# Altium schematic sheet S7CAS-PLEIADES-CARTE-MERE_P20_Engine-Control.SchDoc
size Tabloid; Sheet_Name: Engine Control; Size: 11x17
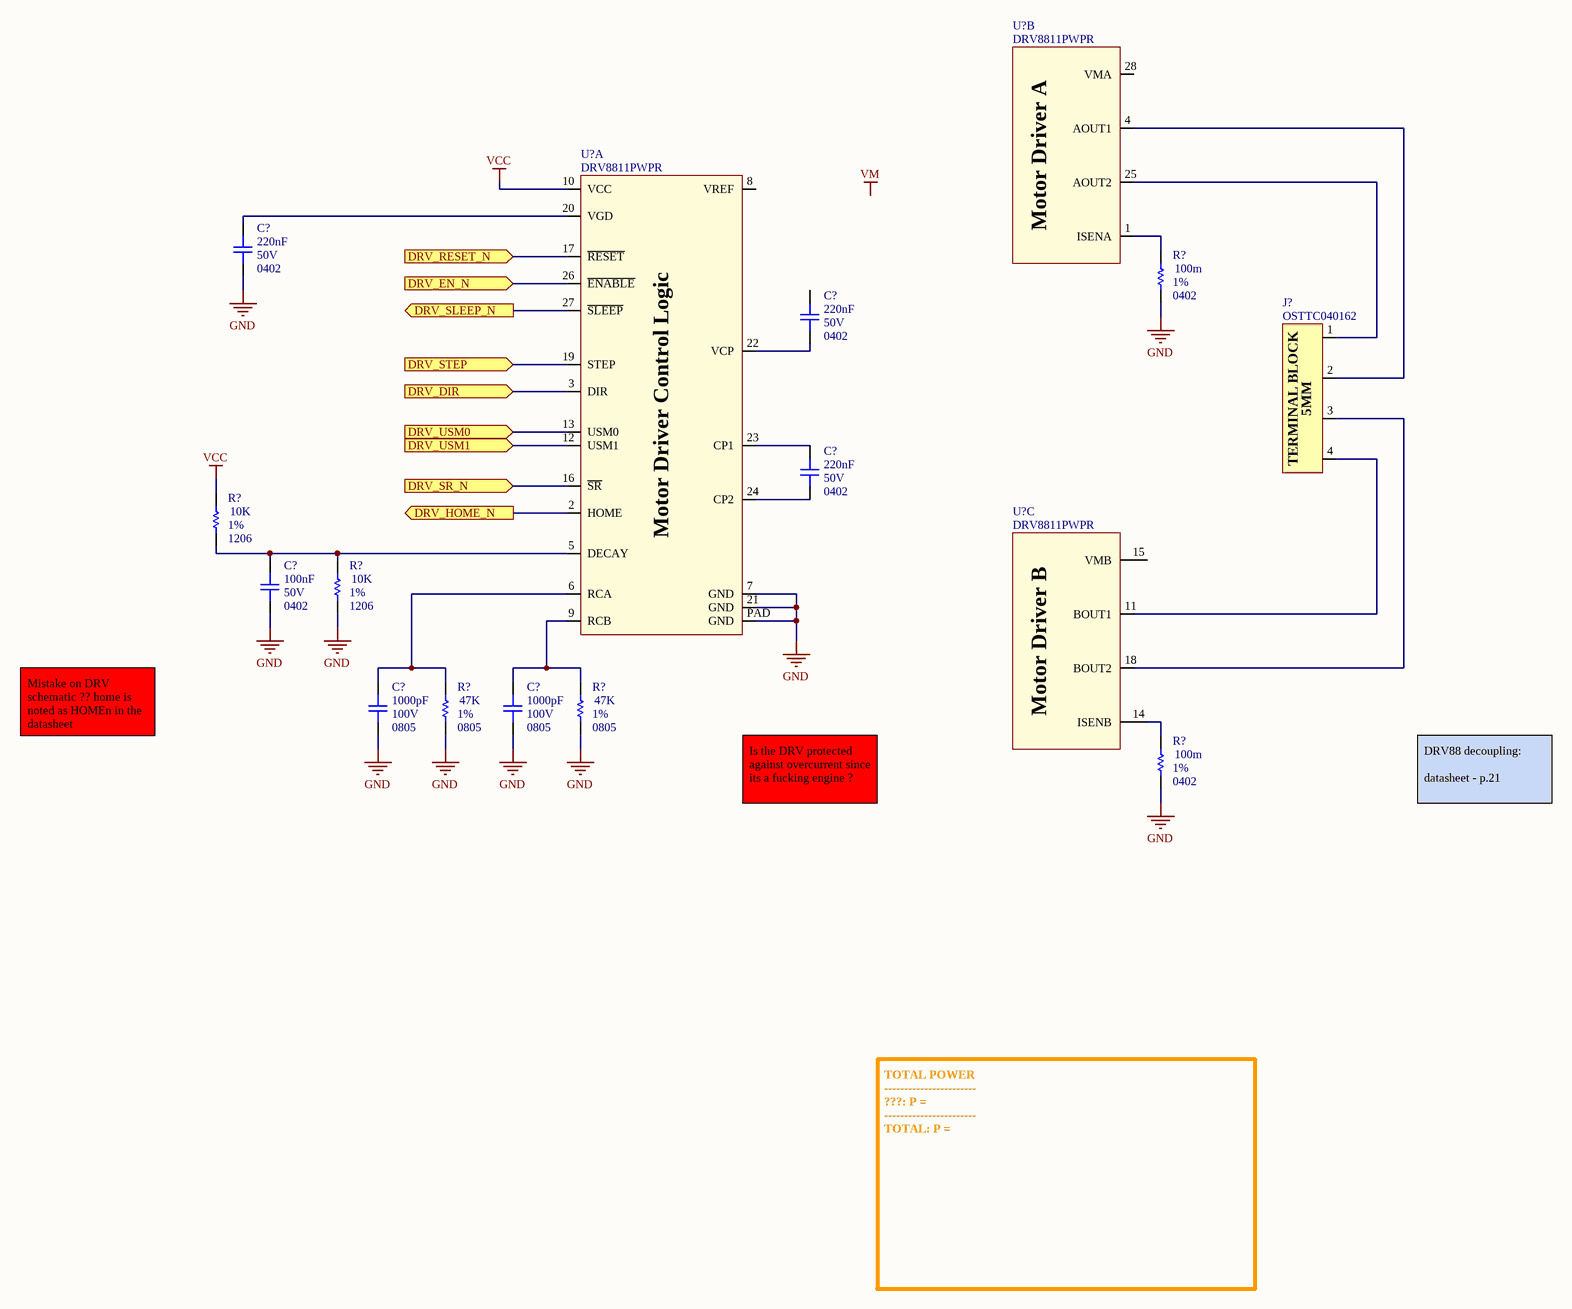
[diagram p0: S7CAS-PLEIADES-CARTE-MERE_P20_Engine-Control.SchDoc]

## Parts
(Parts that share a designator on the sheet are numbered #1, #2 ... from top to bottom, then left to right.)
C?#1  value 220nF  Voltage: 50V  Package: 0402  [CAP_0201]  (hidden comment: CAP - 0201)
C?#2  value 220nF  Voltage: 50V  Package: 0402  [CAP_0201]  (hidden comment: CAP - 0201)
C?#3  value 220nF  Voltage: 50V  Package: 0402  [CAP_0201]  (hidden comment: CAP - 0201)
C?#4  value 100nF  Voltage: 50V  Package: 0402  [CAP_0201]  (hidden comment: CAP - 0201)
C?#5  value 1000pF  Voltage: 100V  Package: 0805  [CAP_0201]  (hidden comment: CAP - 0201)
C?#6  value 1000pF  Voltage: 100V  Package: 0805  [CAP_0201]  (hidden comment: CAP - 0201)
J?  OSTTC040162  [CONN_TERMINAL_OSTTA040161]
R?#1  value 100m  Package: 0402  Precision: 1%  [RES_0402]  (hidden comment: RES - 0402)
R?#2  value 10K  Package: 1206  Precision: 1%  [RES_0402]  (hidden comment: RES - 0402)
R?#3  value 10K  Package: 1206  Precision: 1%  [RES_0402]  (hidden comment: RES - 0402)
R?#4  value 47K  Package: 0805  Precision: 1%  [RES_0402]  (hidden comment: RES - 0402)
R?#5  value 47K  Package: 0805  Precision: 1%  [RES_0402]  (hidden comment: RES - 0402)
R?#6  value 100m  Package: 0402  Precision: 1%  [RES_0402]  (hidden comment: RES - 0402)
U?#1  DRV8811PWPR  [POW_MOTOR_DRV8811PWPR]  (part B of 3)
U?#2  DRV8811PWPR  [POW_MOTOR_DRV8811PWPR]  (part A of 3)
U?#3  DRV8811PWPR  [POW_MOTOR_DRV8811PWPR]  (part C of 3)

## Ports
DRV_DIR (in), DRV_EN_N (in), DRV_HOME_N (out), DRV_RESET_N (in), DRV_SLEEP_N (out), DRV_SR_N (in), DRV_STEP (in), DRV_USM0 (in), DRV_USM1 (in)

## Nets
GND: C?#1.1 C?#4.1 C?#5.1 C?#6.1 R?#1.1 R?#3.1 R?#4.1 R?#5.1 R?#6.1 U?#2.7(GND) U?#2.21(GND) U?#2.PAD(GND)
VCC: R?#2.2 U?#2.10(VCC)
DRV_DIR: U?#2.3(DIR) ; port DRV_DIR
DRV_EN_N: U?#2.26(~{ENABLE}) ; port DRV_EN_N
DRV_HOME_N: U?#2.2(HOME) ; port DRV_HOME_N
DRV_RESET_N: U?#2.17(~{RESET}) ; port DRV_RESET_N
DRV_SLEEP_N: U?#2.27(~{SLEEP}) ; port DRV_SLEEP_N
DRV_SR_N: U?#2.16(~{SR}) ; port DRV_SR_N
DRV_STEP: U?#2.19(STEP) ; port DRV_STEP
DRV_USM0: U?#2.13(USM0) ; port DRV_USM0
DRV_USM1: U?#2.12(USM1) ; port DRV_USM1
NetC?#1_2: C?#1.2 U?#2.20(VGD)
NetC?#2_1: C?#2.1 U?#2.22(VCP)
NetC?#3_1: C?#3.1 U?#2.24(CP2)
NetC?#3_2: C?#3.2 U?#2.23(CP1)
NetC?#4_2: C?#4.2 R?#2.1 R?#3.2 U?#2.5(DECAY)
NetC?#5_2: C?#5.2 R?#4.2 U?#2.6(RCA)
NetC?#6_2: C?#6.2 R?#5.2 U?#2.9(RCB)
NetJ?_1: J?.1 U?#1.25(AOUT2)
NetJ?_2: J?.2 U?#1.4(AOUT1)
NetJ?_3: J?.3 U?#3.18(BOUT2)
NetJ?_4: J?.4 U?#3.11(BOUT1)
NetR?#1_2: R?#1.2 U?#1.1(ISENA)
NetR?#6_2: R?#6.2 U?#3.14(ISENB)

Not connected (* = marked no-connect by the designer): C?#2 2; U?#1 28(VMA); U?#2 8(VREF); U?#3 15(VMB)

## Notes on the sheet
- Mistake on DRV schematic ?? home is noted as HOMEn in the datasheet
- Is the DRV protected against overcurrent since its a fucking engine ?
- DRV88 decoupling:
  datasheet - p.21
- TOTAL POWER
  -----------------------
  ???: P =
  -----------------------
  TOTAL: P =
- Labels drawn without touching a wire or pin: VM
- Sheet Name
- Project Title
- Global Project
- Size
- Group
- Revision
- Date
- Sheet
- of
- Filename
- Designers
- (in symbol CONN_TERMINAL_OSTTC040162) TERMINAL BLOCK; 5MM
- (in symbol POW_MOTOR_DRV8811PWPR, part A) Motor Driver Control Logic
- (in symbol POW_MOTOR_DRV8811PWPR, part B) Motor Driver A
- (in symbol POW_MOTOR_DRV8811PWPR, part C) Motor Driver B

## Library data of the parts
C?#1-C?#3 = CAP - 0201: Mfg Part Number: GRM155R61H224ME01; Precision: 10%; Current: *; CreatedBy: Jonathan Bouchard; Power: *
C?#4 = CAP - 0201: Mfg Part Number: GRM155R60J104KA01; Precision: 10%; Current: *; CreatedBy: Jonathan Bouchard; Power: *
C?#5 C?#6 = CAP - 0201: Mfg Part Number: GRJ216R72A102KE01; Precision: 10%; Current: *; CreatedBy: Jonathan Bouchard; Power: *
J? = CONN_TERMINAL_OSTTC040162: CONN -  TERMINAL BLOCK 4POS 5MM - TH; Mfg: On Shore Technology Inc.; Voltage: *; Current: *; Power: *; Mfg Part Number: OSTTC040162; HelpURL: http://www.on-shore.com/wp-content/uploads/2015/09/osttcxx0162.pdf; CreatedBy: Jonathan Bouchard; Temperature: -30°C ~ 105°C; Value: *; Precision: *; Package: TH-4; Supplier 1: Digikey; Supplier Part Number 1: ED2602-ND
R?#1 R?#6 = RES - 0402: Mfg Part Number: ERJ-2BWFR100X; Voltage: 50V; Power: 1/2W; Current: *; CreatedBy: Jonathan Bouchard
R?#2 R?#3 = RES - 0402: Mfg Part Number: CRM1206-FX-1002ELF; Voltage: 50V; Power: 1/2W; Current: *; CreatedBy: Jonathan Bouchard
R?#4 R?#5 = RES - 0402: Mfg Part Number: CRCW080547K0FKECHP; Voltage: 50V; Power: 1/2W; Current: *; CreatedBy: Jonathan Bouchard
U?#1-U?#3 = POW_MOTOR_DRV8811PWPR: POW - STEPPER MOTOR DRIVER - SOP-28; Voltage: 3 V ~ 5.5 V / 8 V ~ 38 V; Mfg: Texas Instrument; Current: *; Power: *; Mfg Part Number: DRV8811PWPR; HelpURL: http://www.ti.com/lit/ds/symlink/drv8811.pdf; CreatedBy: Jonathan Bouchard; Temperature: -40°C ~ 150°C (TJ); Value: *; Precision: *; Package: SOP-28; Supplier 1: Digikey; Supplier Part Number 1: 296-24591-1-ND